# EAGLE design reference-tee-15pin (EAGLE 7.7.0)
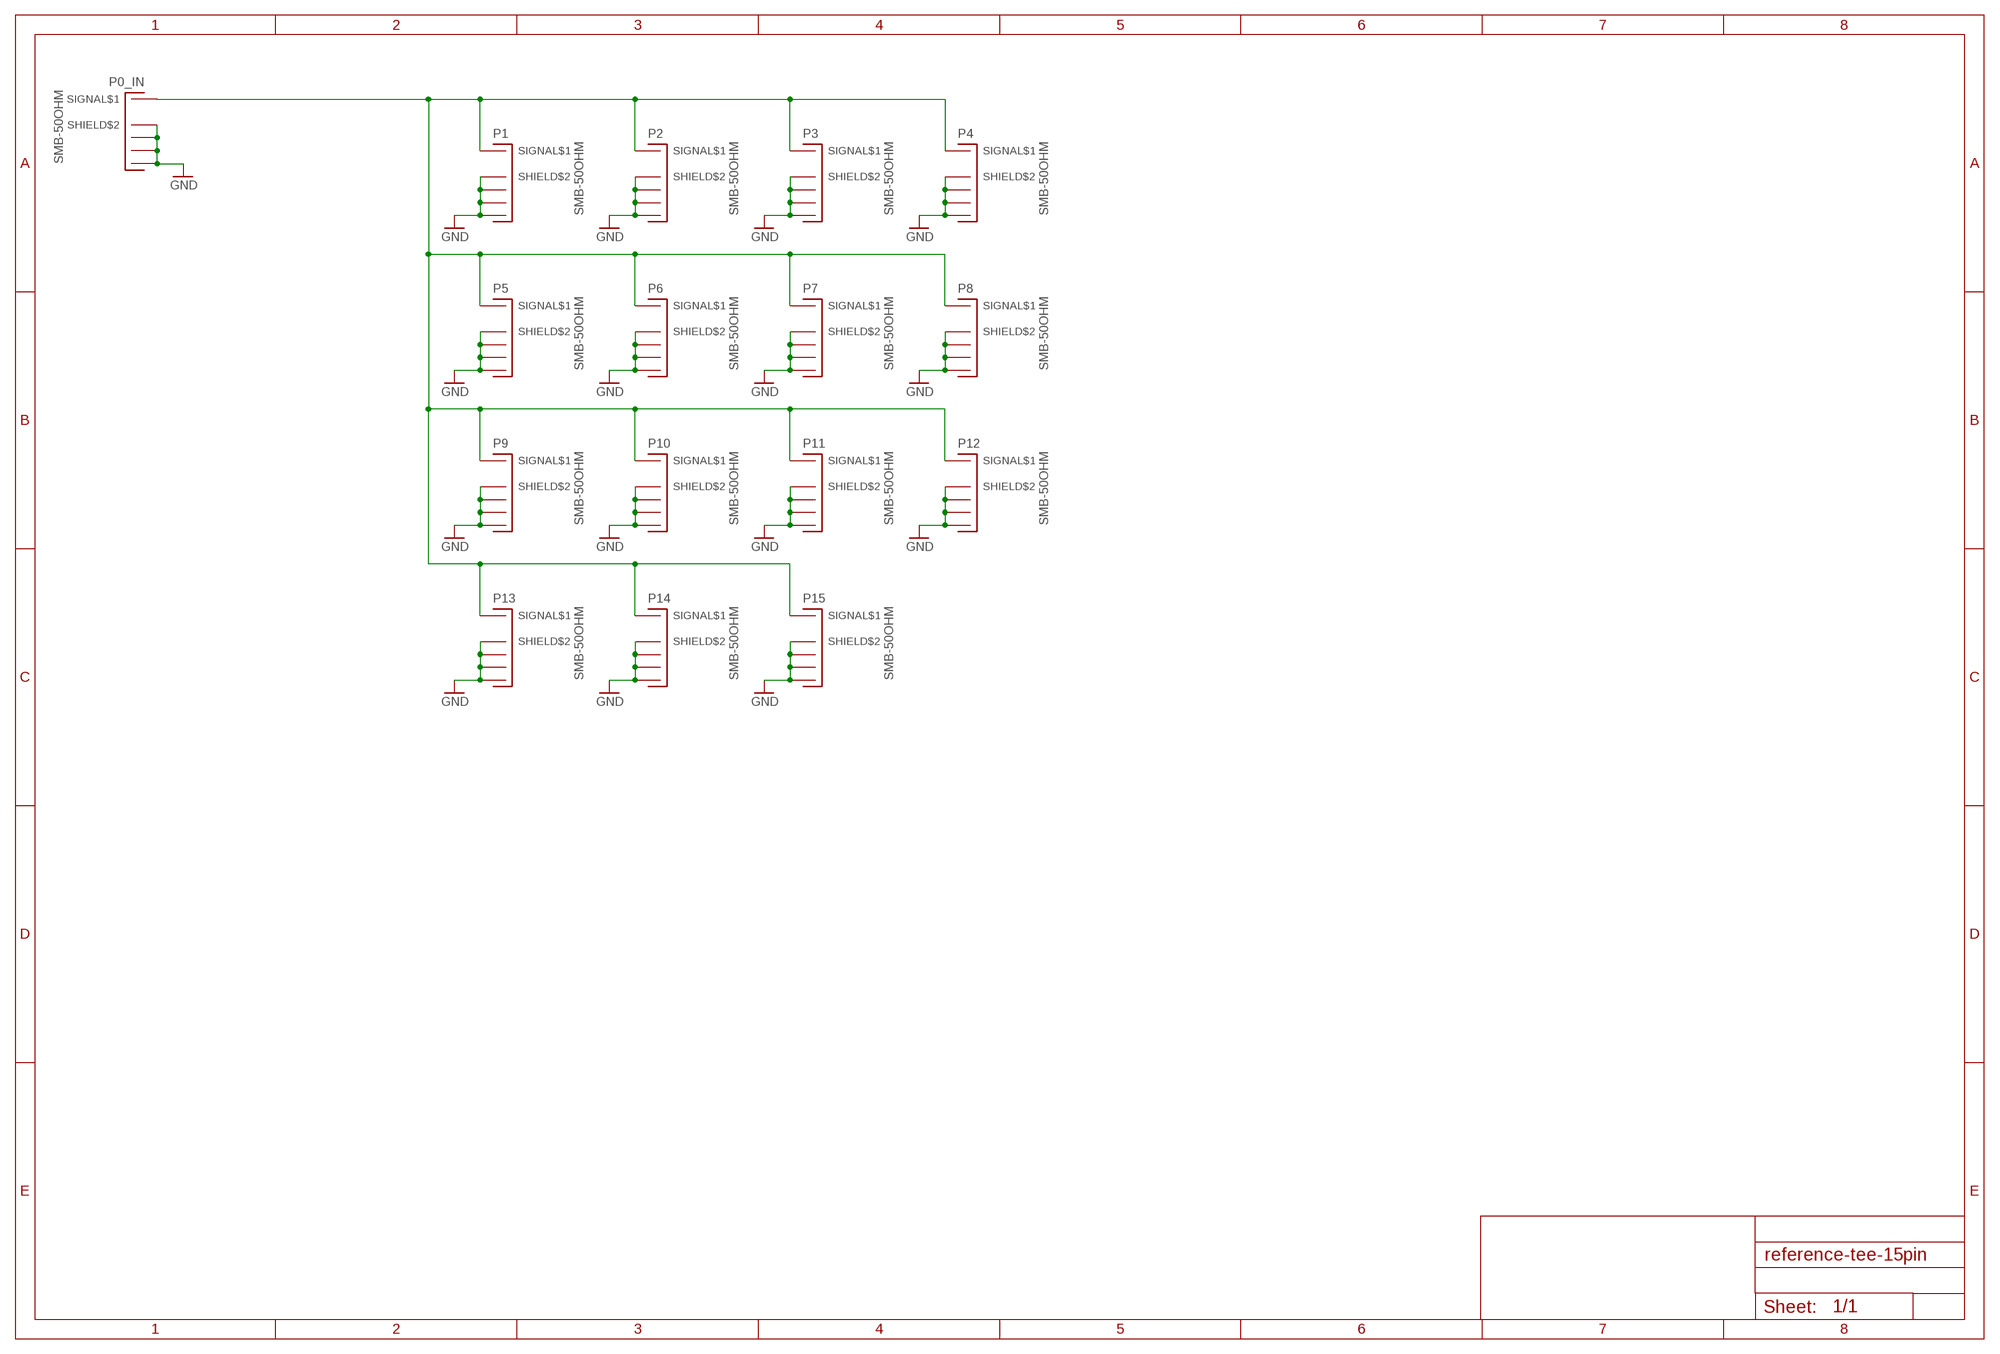
[diagram p0: schematic, sheet 1]

## Parts
P0_IN  SMB-50OHM  [B-30]
P1  SMB-50OHM  [B-30]
P2  SMB-50OHM  [B-30]
P3  SMB-50OHM  [B-30]
P4  SMB-50OHM  [B-30]
P5  SMB-50OHM  [B-30]
P6  SMB-50OHM  [B-30]
P7  SMB-50OHM  [B-30]
P8  SMB-50OHM  [B-30]
P9  SMB-50OHM  [B-30]
P10  SMB-50OHM  [B-30]
P11  SMB-50OHM  [B-30]
P12  SMB-50OHM  [B-30]
P13  SMB-50OHM  [B-30]
P14  SMB-50OHM  [B-30]
P15  SMB-50OHM  [B-30]

## Nets
GND: P0_IN.P$2(SHIELD$2) P0_IN.P$3(SHIELD$3) P0_IN.P$4(SHIELD$4) P0_IN.P$5(SHIELD$5) P1.P$2(SHIELD$2) P1.P$3(SHIELD$3) P1.P$4(SHIELD$4) P1.P$5(SHIELD$5) P2.P$2(SHIELD$2) P2.P$3(SHIELD$3) P2.P$4(SHIELD$4) P2.P$5(SHIELD$5) P3.P$2(SHIELD$2) P3.P$3(SHIELD$3) P3.P$4(SHIELD$4) P3.P$5(SHIELD$5) P4.P$2(SHIELD$2) P4.P$3(SHIELD$3) P4.P$4(SHIELD$4) P4.P$5(SHIELD$5) P5.P$2(SHIELD$2) P5.P$3(SHIELD$3) P5.P$4(SHIELD$4) P5.P$5(SHIELD$5) P6.P$2(SHIELD$2) P6.P$3(SHIELD$3) P6.P$4(SHIELD$4) P6.P$5(SHIELD$5) P7.P$2(SHIELD$2) P7.P$3(SHIELD$3) P7.P$4(SHIELD$4) P7.P$5(SHIELD$5) P8.P$2(SHIELD$2) P8.P$3(SHIELD$3) P8.P$4(SHIELD$4) P8.P$5(SHIELD$5) P9.P$2(SHIELD$2) P9.P$3(SHIELD$3) P9.P$4(SHIELD$4) P9.P$5(SHIELD$5) P10.P$2(SHIELD$2) P10.P$3(SHIELD$3) P10.P$4(SHIELD$4) P10.P$5(SHIELD$5) P11.P$2(SHIELD$2) P11.P$3(SHIELD$3) P11.P$4(SHIELD$4) P11.P$5(SHIELD$5) P12.P$2(SHIELD$2) P12.P$3(SHIELD$3) P12.P$4(SHIELD$4) P12.P$5(SHIELD$5) P13.P$2(SHIELD$2) P13.P$3(SHIELD$3) P13.P$4(SHIELD$4) P13.P$5(SHIELD$5) P14.P$2(SHIELD$2) P14.P$3(SHIELD$3) P14.P$4(SHIELD$4) P14.P$5(SHIELD$5) P15.P$2(SHIELD$2) P15.P$3(SHIELD$3) P15.P$4(SHIELD$4) P15.P$5(SHIELD$5)
N$1: P0_IN.P$1(SIGNAL$1) P1.P$1(SIGNAL$1) P2.P$1(SIGNAL$1) P3.P$1(SIGNAL$1) P4.P$1(SIGNAL$1) P5.P$1(SIGNAL$1) P6.P$1(SIGNAL$1) P7.P$1(SIGNAL$1) P8.P$1(SIGNAL$1) P9.P$1(SIGNAL$1) P10.P$1(SIGNAL$1) P11.P$1(SIGNAL$1) P12.P$1(SIGNAL$1) P13.P$1(SIGNAL$1) P14.P$1(SIGNAL$1) P15.P$1(SIGNAL$1)

## Library data of the parts
P0_IN P1-P15 = parts:SMB-50OHM

## Board
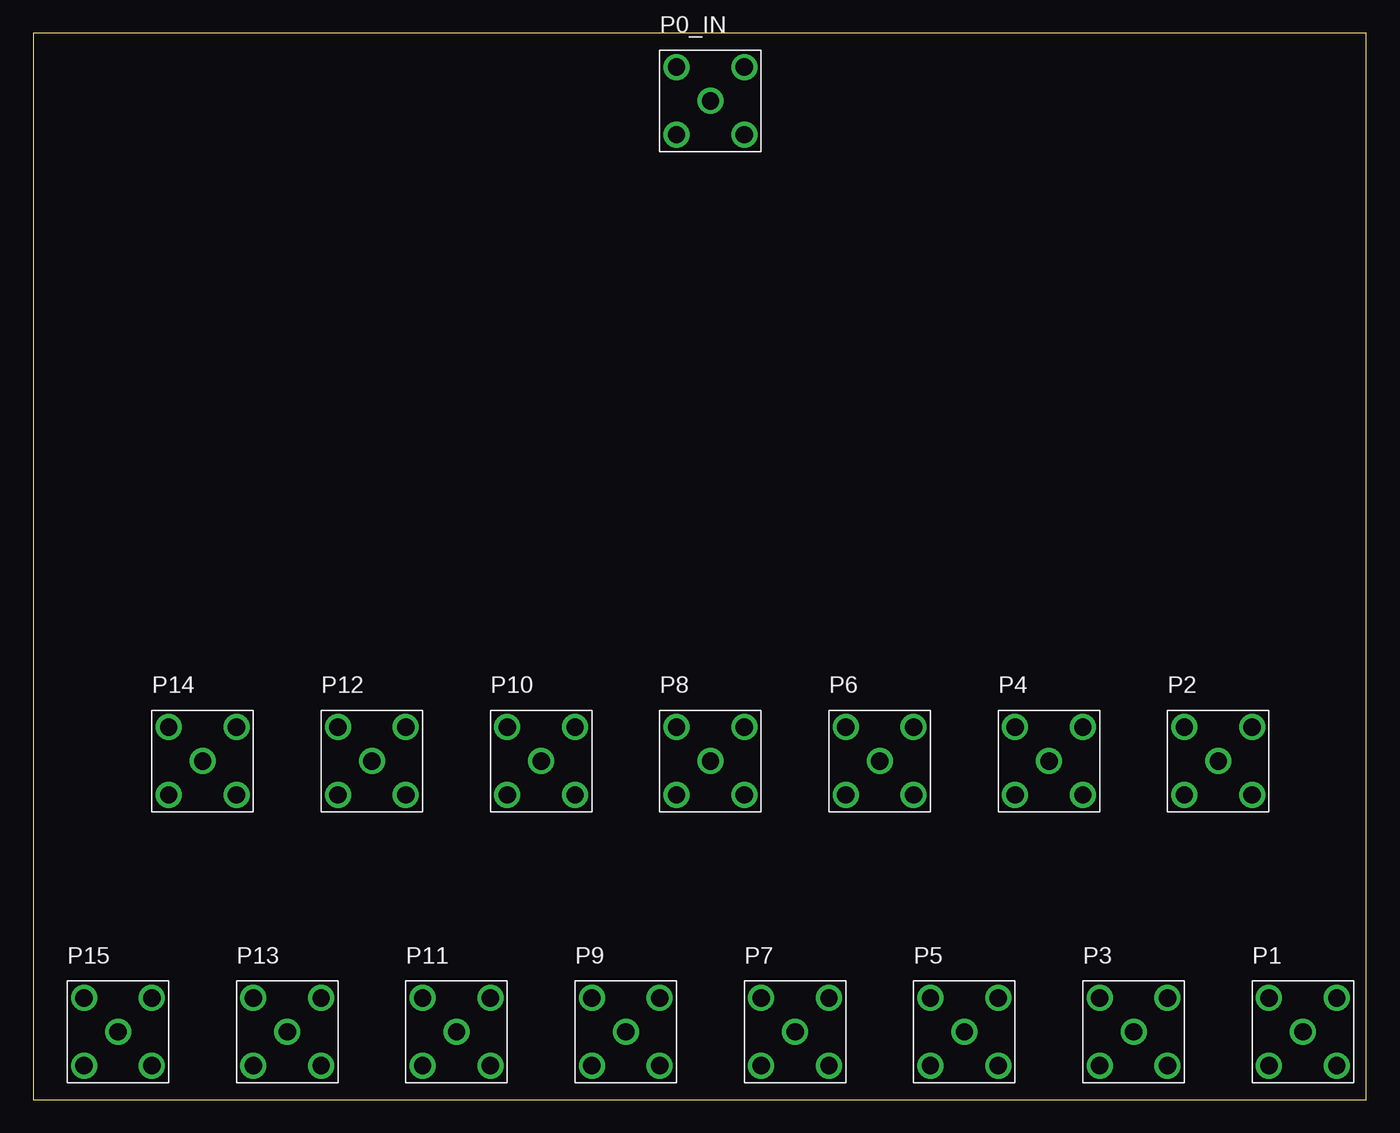
[diagram p1: board, top side]
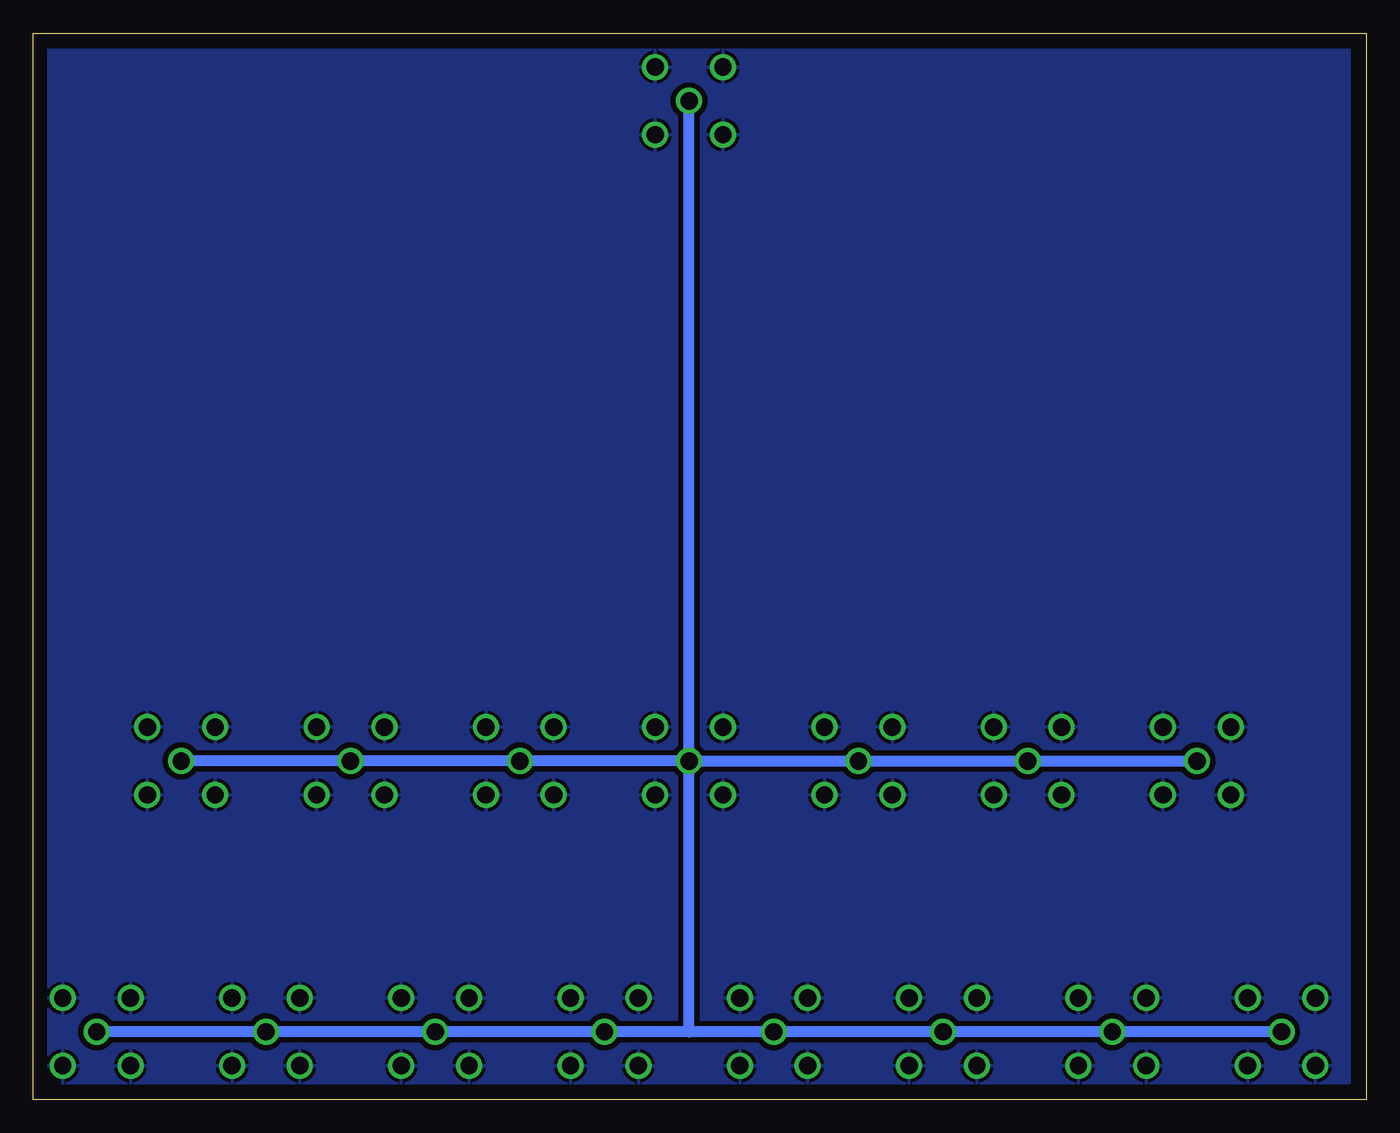
[diagram p2: board, bottom side, seen from below]

Size 100 x 80 mm. Coordinates in mm from the lower left corner, seen from the top.
Outline: 0,0 100,0 100,80 0,80 0,0
Copper layers (1*16): Top 0.035mm / dielectric 1.5mm / Bottom 0.035mm
Design rules "default": minimum track width 10mil, minimum drill 24mil, track to track 8mil, track to pad 8mil, pad to pad 8mil, via to via 8mil, smd to smd 8mil, copper to edge 40mil, drill to drill 8mil, minimum pad ring 10mil, minimum via ring 8mil, stop-mask expansion 4mil, vias tented up to drill 0mil, thermal gap 10mil

### Footprints (pad centres in the part's own frame; a part is rotated, then mirrored left to right if it is on the bottom)
B-30 = drill 1.3: P$1 0,0; P$2 -2.54,2.54; P$3 -2.54,-2.54; P$4 2.54,-2.54; P$5 2.54,2.54

### Placement (x,y rotation side)
P0_IN  50.8,74.93 0 top
P1  95.25,5.08 0 top
P2  88.9,25.4 0 top
P3  82.55,5.08 0 top
P4  76.2,25.4 0 top
P5  69.85,5.08 0 top
P6  63.5,25.4 0 top
P7  57.15,5.08 0 top
P8  50.8,25.4 0 top
P9  44.45,5.08 0 top
P10  38.1,25.4 0 top
P11  31.75,5.08 0 top
P12  25.4,25.4 0 top
P13  19.05,5.08 0 top
P14  12.7,25.4 0 top
P15  6.35,5.08 0 top

### Tracks (layer width: path | path; a pad name or v marks a point on that pad's centre or on a via)
GND
  pour Bottom (isolate 0.406): 1.27,78.74 99.06,78.74 99.06,1.27 1.27,1.27
N$1
  Bottom 0.813: P8.P$1 P0_IN.P$1 | 50.8,5.08 P8.P$1 | P8.P$1 P10.P$1 P12.P$1 P14.P$1 | P8.P$1 P6.P$1 P4.P$1 P2.P$1 | 50.8,5.08 P7.P$1 P5.P$1 P3.P$1 P1.P$1 | 50.8,5.08 P9.P$1 P11.P$1 P13.P$1 P15.P$1